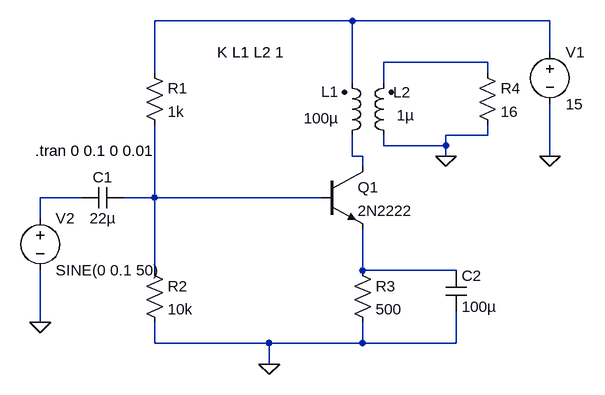
[diagram p0: schematic class a.asc]
class a.asc, the LTspice schematic file:
Version 4
SHEET 1 952 680
WIRE 528 -48 224 -48
WIRE 832 -48 528 -48
WIRE 832 0 832 -48
WIRE 736 16 576 16
WIRE 224 32 224 -48
WIRE 736 32 736 16
WIRE 528 48 528 -48
WIRE 576 48 576 16
WIRE 736 128 736 112
WIRE 736 128 672 128
WIRE 576 144 576 128
WIRE 672 144 672 128
WIRE 672 144 576 144
WIRE 528 160 528 128
WIRE 544 160 528 160
WIRE 672 160 672 144
WIRE 832 160 832 80
WIRE 544 176 544 160
WIRE 112 224 48 224
WIRE 224 224 224 112
WIRE 224 224 176 224
WIRE 480 224 224 224
WIRE 48 256 48 224
WIRE 224 336 224 224
WIRE 544 336 544 272
WIRE 688 336 544 336
WIRE 48 416 48 336
WIRE 224 448 224 416
WIRE 400 448 224 448
WIRE 544 448 544 416
WIRE 544 448 400 448
WIRE 688 448 688 400
WIRE 688 448 544 448
WIRE 400 480 400 448
FLAG 48 416 0
FLAG 832 160 0
FLAG 400 480 0
FLAG 672 160 0
SYMBOL res 208 16 R0
SYMATTR InstName R1
SYMATTR Value 1k
SYMBOL res 208 320 R0
SYMATTR InstName R2
SYMATTR Value 10k
SYMBOL res 528 320 R0
SYMATTR InstName R3
SYMATTR Value 500
SYMBOL res 720 16 R0
SYMATTR InstName R4
SYMATTR Value 16
SYMBOL cap 176 208 R90
WINDOW 0 0 32 VBottom 2
WINDOW 3 32 32 VTop 2
SYMATTR InstName C1
SYMATTR Value 22µ
SYMBOL ind2 592 144 R180
WINDOW 0 85 83 Left 2
WINDOW 3 85 42 Left 2
SYMATTR InstName L1
SYMATTR Value 100µ
SYMATTR Type ind
SYMATTR SpiceLine Rser=40
SYMBOL ind2 512 144 M180
WINDOW 0 79 82 Left 2
WINDOW 3 84 47 Left 2
SYMATTR InstName L2
SYMATTR Value 1µ
SYMATTR Type ind
SYMATTR SpiceLine Rser=40
SYMBOL npn 480 176 R0
SYMATTR InstName Q1
SYMATTR Value 2N2222
SYMBOL voltage 832 -16 R0
WINDOW 123 0 0 Left 0
WINDOW 39 0 0 Left 0
SYMATTR InstName V1
SYMATTR Value 15
SYMBOL voltage 48 240 R0
WINDOW 123 0 0 Left 0
WINDOW 39 0 0 Left 0
SYMATTR InstName V2
SYMATTR Value SINE(0 0.1 50)
SYMBOL cap 672 336 R0
SYMATTR InstName C2
SYMATTR Value 100µ
TEXT 40 152 Left 2 !.tran 0 0.1 0 0.01
TEXT 320 0 Left 2 !K L1 L2 1

The netlist it stands for:
* class a.asc
R1 N001 N005 1k
R2 N005 0 10k
R3 N006 0 500
R4 N002 0 16
C1 N005 N004 22µ
L1 0 N002 100µ Rser=40
L2 N003 N001 1µ Rser=40
Q1 N003 N005 N006 0 2N2222
V1 N001 0 15
V2 N004 0 SINE(0 0.1 50)
C2 N006 0 100µ
.model NPN NPN
.model PNP PNP
.lib standard.bjt
.tran 0 0.1 0 0.01
K L1 L2 1
.backanno
.end